# EAGLE design Lamp Logic Board (EAGLE 9.4.2)
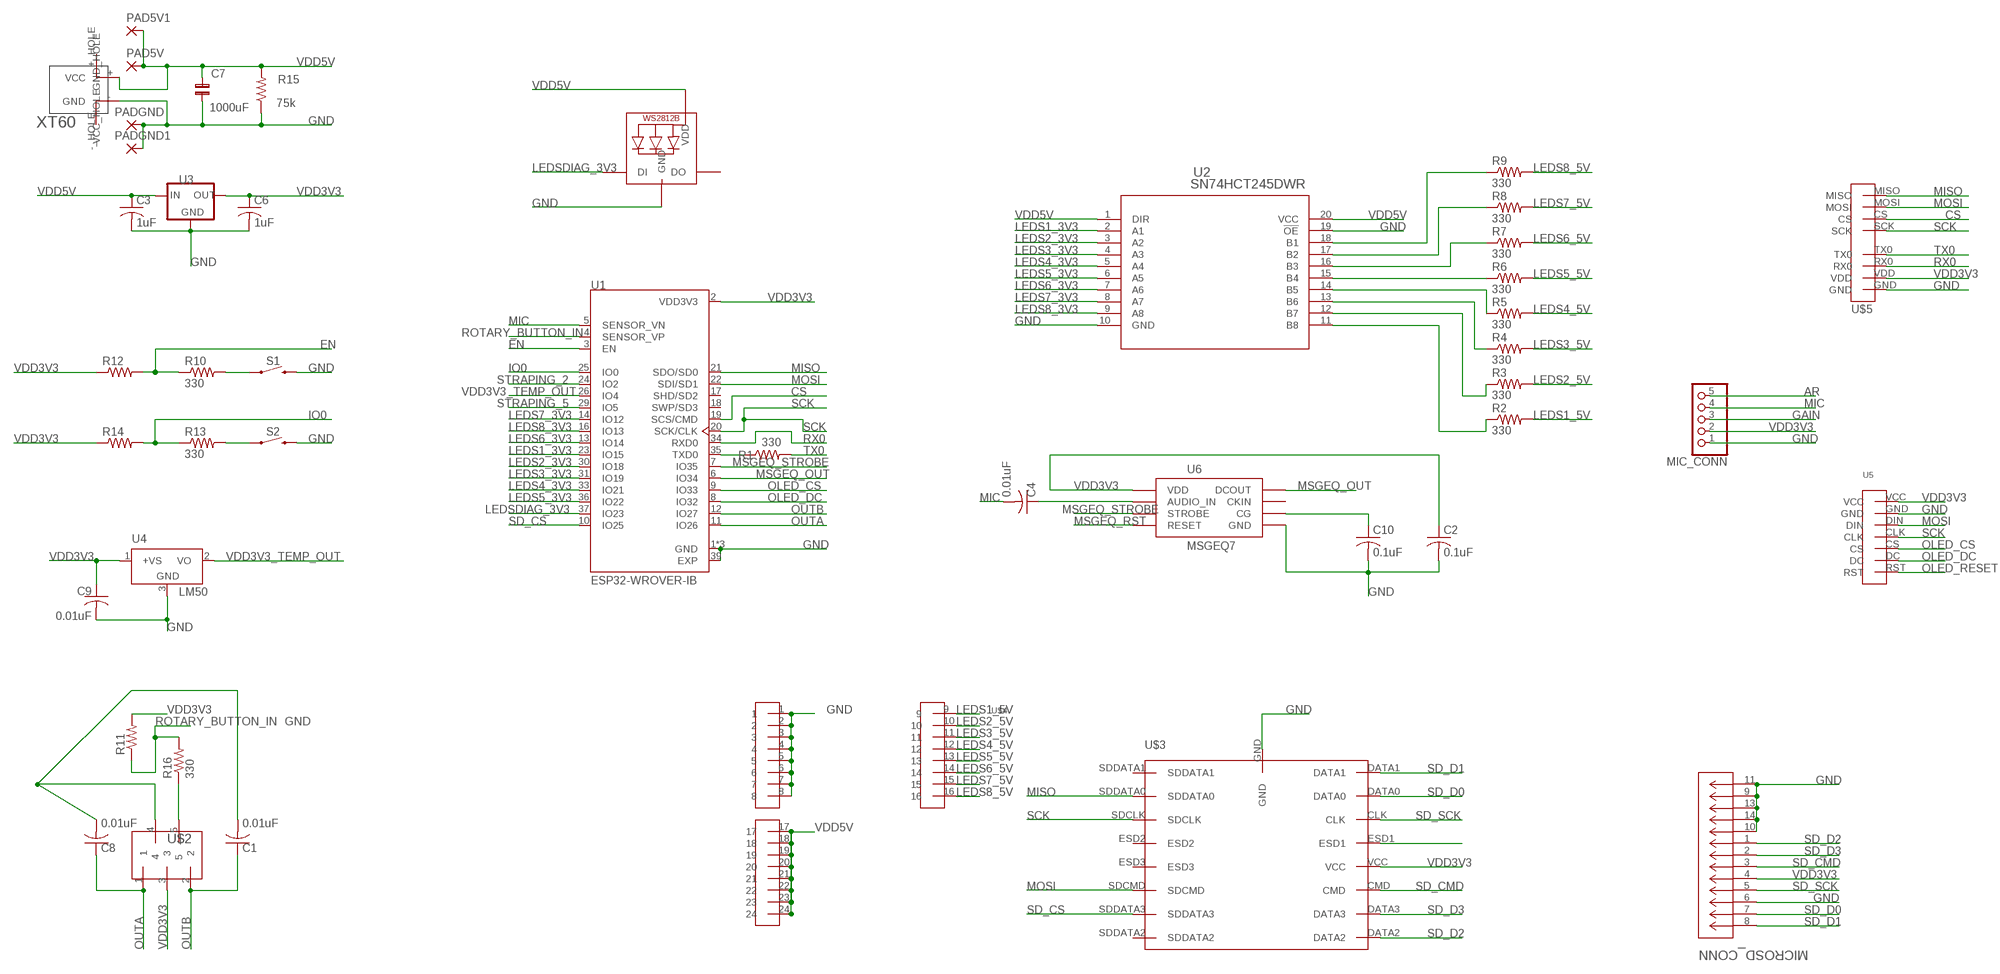
[diagram p0: schematic, sheet 1]

## Parts
C1  0.01uF  C-USC0402  [C0402]
C2  0.1uF  C-USC0805  [C0805]
C3  1uF  C-USC0402  [C0402]
C4  0.01uF  C-USC0402  [C0402]
C6  1uF  C-USC0402  [C0402]
C7  1000uF  C-BP-2,0X5  [ENP2,0-5]
C8  0.01uF  C-USC0402  [C0402]
C9  0.01uF  C-USC0402  [C0402]
C10  0.1uF  C-USC0805  [C0805]
LED1  WS2812B5050  [WS2812B]
MIC_CONN  PINHD-1X5  [1X05]
MICROSD_CONN  LLC  [CON00218_8]
PAD5V  SMD5  [SMD2,54-5,08]
PAD5V1  SMD5  [SMD2,54-5,08]
PADGND  SMD5  [SMD2,54-5,08]
PADGND1  SMD5  [SMD2,54-5,08]
R1  330  R-US_R1206  [R1206]
R2  330  R-US_R1206  [R1206]
R3  330  R-US_R1206  [R1206]
R4  330  R-US_R1206  [R1206]
R5  330  R-US_R1206  [R1206]
R6  330  R-US_R1206  [R1206]
R7  330  R-US_R1206  [R1206]
R8  330  R-US_R1206  [R1206]
R9  330  R-US_R1206  [R1206]
R10  330  R-US_R1206  [R1206]
R11  R-US_R0603  [R0603]
R12  R-US_R0603  [R0603]
R13  330  R-US_R1206  [R1206]
R14  R-US_R0603  [R0603]
R15  75k  R-US_0309/12  [0309/12]
R16  330  R-US_R1206  [R1206]
S1  MOMENTARY-SWITCH-SPST-SMD-6.0X3.5MM  [TACTILE_SWITCH_SMD_6.0X3.5MM]
S2  MOMENTARY-SWITCH-SPST-SMD-6.0X3.5MM  [TACTILE_SWITCH_SMD_6.0X3.5MM]
U1  ESP32-WROVER-IB  ESP32-WROVER-I  [XCVR_ESP32-WROVER-I]
U2  SN74HCT245DWR  [DW20]
U3  LM1117MP-1.8  [SOT223]
U4  LM50  [SOT23]
U5  SPIOLED_STANDOFF  [SPIOLED_STADOFF]
U6  MSGEQ7DIL  [DIL-08]
U$1  XT60  [XT60]
U$2  EN11-HSM1AF15  [EN11-HSM]
U$3  CM1624-08DE  [CM1624-08DE]
U$4  3X8PINHEAD  [3X8PINHEAD]
U$5  2X4PINHEAD  [2X4PINHEAD]

## Nets
AR: MIC_CONN.5
CS: U1.19(SCS/CMD) U$5.CS
EN: R10.1 R12.2 U1.3(EN)
GAIN: MIC_CONN.3
GND: C1.2 C2.2 C3.2 C6.2 C7.1 C8.2 C9.2 C10.2 LED1.3-GND(GND) MIC_CONN.1 MICROSD_CONN.6 MICROSD_CONN.9 MICROSD_CONN.10 MICROSD_CONN.11 MICROSD_CONN.13 MICROSD_CONN.14 PADGND1.1(P) PADGND.1(P) R15.1 S1.2 S2.2 U1.1(GND) U1.15(GND) U1.38(GND) U1.39(EXP) U2.10(GND) U2.19(!OE) U3.1(GND) U4.3(GND) U5.GND U6.2(GND) U$1.-(GND) U$2.4 U$3.GND U$4.1 U$4.2 U$4.3 U$4.4 U$4.5 U$4.6 U$4.7 U$4.8 U$5.GND
IO0: R13.1 R14.2 U1.25(IO0)
LEDS1_3V3: U1.23(IO15) U2.2(A1)
LEDS1_5V: R2.2 U$4.9
LEDS2_3V3: U1.30(IO18) U2.3(A2)
LEDS2_5V: R3.2 U$4.10
LEDS3_3V3: U1.31(IO19) U2.4(A3)
LEDS3_5V: R4.2 U$4.11
LEDS4_3V3: U1.33(IO21) U2.5(A4)
LEDS4_5V: R5.2 U$4.12
LEDS5_3V3: U1.36(IO22) U2.6(A5)
LEDS5_5V: R6.2 U$4.13
LEDS6_3V3: U1.13(IO14) U2.7(A6)
LEDS6_5V: R7.2 U$4.14
LEDS7_3V3: U1.14(IO12) U2.8(A7)
LEDS7_5V: R8.2 U$4.15
LEDS8_3V3: U1.16(IO13) U2.9(A8)
LEDS8_5V: R9.2 U$4.16
LEDSDIAG_3V3: LED1.4-DIN(DI) U1.37(IO23)
MIC: C4.2 MIC_CONN.4 U1.5(SENSOR_VN)
MISO: U1.21(SDO/SD0) U$3.SDDATA0 U$5.MISO
MOSI: U1.22(SDI/SD1) U5.DIN U$3.SDCMD U$5.MOSI
MSGEQ_OUT: U1.6(IO34) U6.3(DCOUT)
MSGEQ_RST: U6.7(RESET)
MSGEQ_STROBE: U1.7(IO35) U6.4(STROBE)
N$1: R9.1 U2.18(B1)
N$2: R1.1 U1.35(TXD0)
N$3: C4.1 U6.5(AUDIO_IN)
N$4: C10.1 U6.6(CG)
N$5: R16.1 U$2.5
N$6: R8.1 U2.17(B2)
N$7: R13.2 S2.1
N$8: U$3.ESD1
N$9: R10.2 S1.1
N$10: R7.1 U2.16(B3)
N$11: R6.1 U2.15(B4)
N$12: R5.1 U2.14(B5)
N$13: R4.1 U2.13(B6)
N$14: R3.1 U2.12(B7)
N$15: R2.1 U2.11(B8)
OLED_CS: U1.9(IO33) U5.CS
OLED_DC: U1.8(IO32) U5.DC
OLED_RESET: U5.RST
OUTA: C8.1 U1.11(IO26) U$2.1
OUTB: C1.1 U1.12(IO27) U$2.2
ROTARY_BUTTON_IN: R11.1 R16.2 U1.4(SENSOR_VP)
RX0: U1.34(RXD0) U$5.RX0
SCK: U1.20(SCK/CLK) U5.CLK U$3.SDCLK U$5.SCK
SD_CMD: MICROSD_CONN.3 U$3.CMD
SD_CS: U1.10(IO25) U$3.SDDATA3
SD_D0: MICROSD_CONN.7 U$3.DATA0
SD_D1: MICROSD_CONN.8 U$3.DATA1
SD_D2: MICROSD_CONN.1 U$3.DATA2
SD_D3: MICROSD_CONN.2 U$3.DATA3
SD_SCK: MICROSD_CONN.5 U$3.CLK
STRAPING_2: U1.24(IO2)
STRAPING_5: U1.29(IO5)
TX0: R1.2 U$5.TX0
VDD3V3: C2.1 C6.1 C9.1 MIC_CONN.2 MICROSD_CONN.4 R11.2 R12.1 R14.1 U1.2(VDD3V3) U3.2(OUT) U3.4(OUT) U4.1(+VS) U5.VCC U6.1(VDD) U$2.3 U$3.VCC U$5.VDD
VDD3V3_TEMP_OUT: U1.26(IO4) U4.2(VO)
VDD5V: C3.1 C7.2 LED1.1-VDD(VDD) PAD5V1.1(P) PAD5V.1(P) R15.2 U2.1(DIR) U2.20(VCC) U3.3(IN) U$1.+(VCC) U$4.17 U$4.18 U$4.19 U$4.20 U$4.21 U$4.22 U$4.23 U$4.24
Unconnected: LED1.2-DOUT(DO) U1.17(SHD/SD2) U1.18(SWP/SD3) U6.8(CKIN) U$1.+_HOLE(VCC_HOLE) U$1.-_HOLE(GND_HOLE) U$3.ESD2 U$3.ESD3 U$3.SDDATA1 U$3.SDDATA2

## Library data of the parts
C1-C4 C6 C8-C10 = resistor:C-US: CAPACITOR, American symbol
C7 = cap-pan40:C-BP: BIPOLAR ELECTROLYTIC
LED1 = WS2812B:WS2812B; AVAILABILITY: Unavailable; DESCRIPTION: Intelligent Control Led Integrated Light Source Pack Of 10; MF: Seeed Technology; MP: WS2812B; PACKAGE: None; PRICE: None
MIC_CONN = pinhead:PINHD-1X5: PIN HEADER
MICROSD_CONN = 5027740891:LLC; MANUFACTURER_PART_NUMBER: LLC; VENDOR: Molex Connector Corporation
PAD5V PAD5V1 PADGND PADGND1 = wirepad:SMD5: SMD PAD
R1-R16 = resistor:R-US_: RESISTOR, American symbol
S1 S2 = SparkFun-Switches:MOMENTARY-SWITCH-SPST: Momentary Switch (Pushbutton) - SPST Normally-open (NO) SPST momentary switches (buttons, pushbuttons). Variants PTH-12MM - 12mm square, through-hole Momentary Pushbutton Switch - 12mm Square <https://www.sparkfun.com/products/9190> (COM-09190) PTH-6.0MM, PTH-6.0MM-KIT - 6.0mm square, through-hole Mini Pushbutton Switch <https://www.sparkfun.com/products/97> (COM-00097) KIT package intended for soldering kit's - only one side of pads' copper is exposed. PTH-RIGHT-ANGLE-KIT - Right-angle, through-hole Right Angle Tactile Button <https://www.sparkfun.com/products/10791> - Used on SparkFun BigTime Watch Kit <https://www.sparkfun.com/products/11734> SMD-12MM - 12mm square, surface-mount Tactile Button - SMD (12mm) <https://www.sparkfun.com/products/12993> (COM-12993) Used on SparkFun PicoBoard <https://www.sparkfun.com/products/11888> SMD-4.5MM - 4.5mm Square Trackball Switch Used on SparkFun Blackberry Trackballer Breakout <https://www.sparkfun.com/products/13169> SMD-4.6MMX2.8MM - 4.60mm x 2.80mm, surface mount Used on SparkFun SAMD21 Mini Breakout <https://www.sparkfun.com/products/13664> SMD-5.2MM, SMD-5.2-REDUNDANT - 5.2mm square, surface-mount Mini Pushbutton Switch - SMD <https://www.sparkfun.com/products/8720> (COM-08720) Used on Arduino Pro Mini <https://www.sparkfun.com/products/11114> REDUNDANT package connects both switch circuits together SMD-6.0X3.5MM - 6.0 x 3.5mm, surface mount Momentary Reset Switch SMD <https://www.sparkfun.com/products/8229> (COM-08229) SMD-6.2MM-TALL - 6.2mm square, surface mount Tactile Button - SMD (6mm) <https://www.sparkfun.com/products/12992> Used on SparkFun Digital Sandbox <https://www.sparkfun.com/products/12651> SMD-RIGHT-ANGLE - Right-angle, surface mount Used on SparkFun Block for Intel® Edison - Arduino <https://www.sparkfun.com/products/13036>; PROD_ID: SWCH-00815; SF_SKU: COM-08229
U1 = ESP32-WROVER-I:ESP32-WROVER-I: Module: combo; GPIO, I2C x2, I2S x2, SDIO, SPI x3, UART x3; U.FL; AVAILABILITY: Unavailable; DESCRIPTION: Module: combo; GPIO, I2C x2, I2S x2, SDIO, SPI x3, UART x3; U.FL; MF: Espressif Systems; MP: ESP32-WROVER-I; PACKAGE: Module Espressif Systems; PRICE: None
U2 = SN74HCT245DWR :SN74HCT245DWR; MANUFACTURER_PART_NUMBER: SN74HCT245DWR; VENDOR: Texas Instruments
U3 = lm1117:LM1117?-*: 800mA Low-Dropout Linear Regulator Source: http://ww1.microchip.com/downloads/en/DeviceDoc/39760d.pdf; MF: Texas Instruments; MPN: LM1117MP-1.8; OC_FARNELL: 1469053; OC_NEWARK: 41K3467
U4 = linear:LM50: SOT-23 Single-Supply Centigrade Temperature Sensor Vout = (10mV/°C x Temp °C) +5mmmV Source: http://cache.national.com/ds/LM/LM50.pdf
U5 = SPIOLED-STANDOFF:SPIOLED_STANDOFF
U6 = MSGEQ7:MSGEQ7: 7-band graphic equalizer; DESCRIPTION: Seven Band Graphic Equalizer Display Filter; DIGI-KEY_PART_NUMBER: 1568-1544-ND; DIGI-KEY_PURCHASE_URL: https://www.digikey.com/product-detail/en/sparkfun-electronics/DEV-13116/1568-1544-ND/5764478?utm_source=snapeda&utm_medium=aggregator&utm_campaign=symbol; MF: SparkFun Electronics; MP: MSGEQ7; PACKAGE: SOIC-8 Mixed Signal Integration
U$1 = XT60:XT60: XT60
U$2 = untitled:EN11-HSM1AF15
U$3 = CM1624-08DE:CM1624-08DE
U$4 = 3X8PINHEAD:3X8PINHEAD
U$5 = 2X4PINHEAD:2X4PINHEAD

## Board
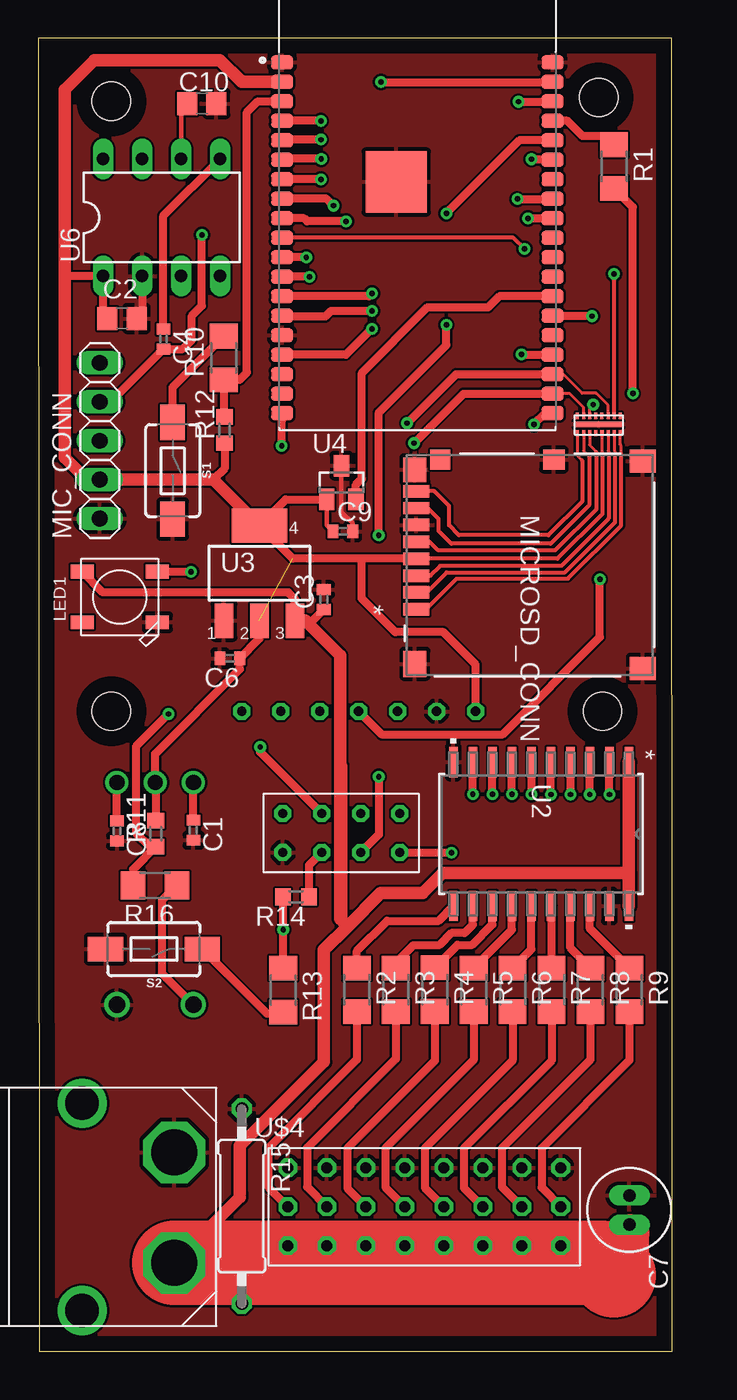
[diagram p1: board, top side]
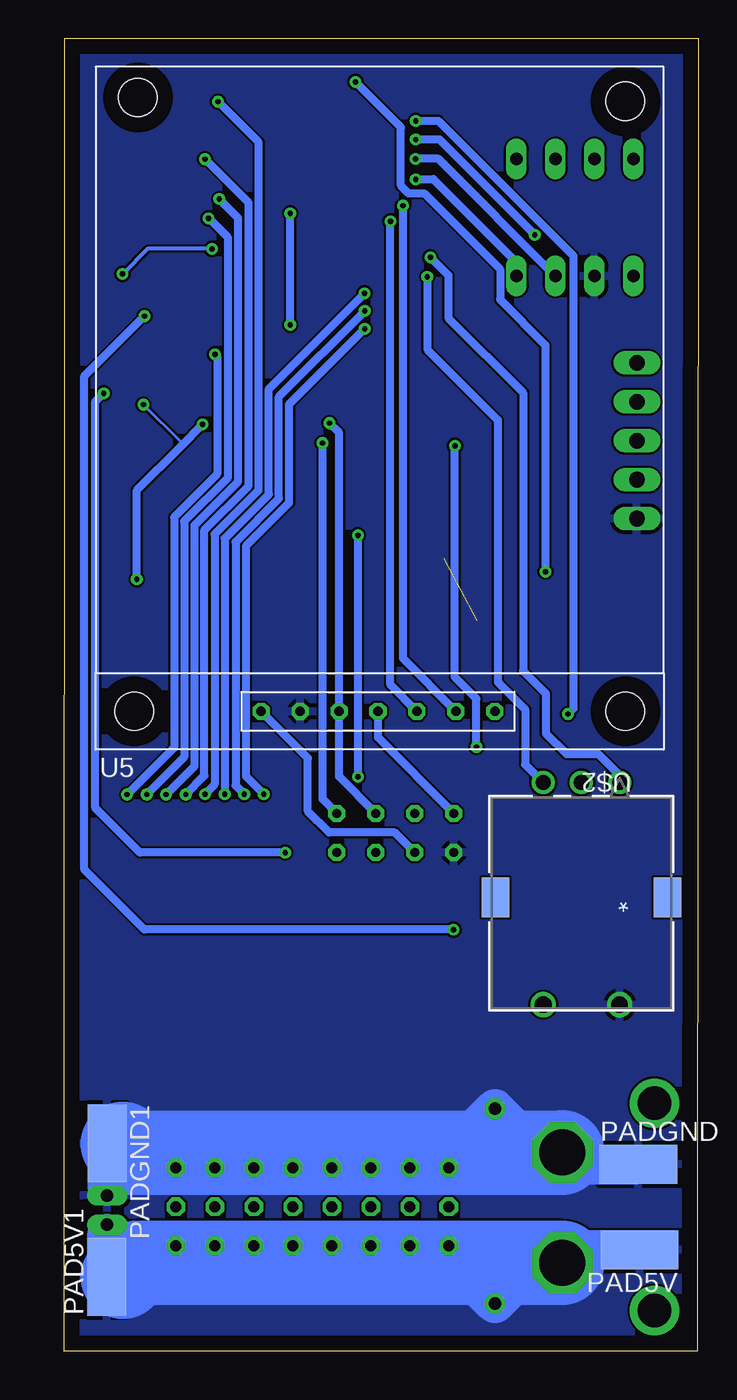
[diagram p2: board, bottom side, seen from below]

Size 41.3 x 85.55 mm. Coordinates in mm from the lower left corner, seen from the top.
Outline: 0.05,0 41.3,0 41.25,85.55 0,85.55 0.05,0
Copper layers (1*16): Top 0.035mm / dielectric 1.5mm / Bottom 0.035mm
Design rules "default": minimum track width 6mil, minimum drill 0.35mm, track to track 6mil, track to pad 6mil, pad to pad 6mil, via to via 6mil, smd to smd 6mil, copper to edge 40mil, drill to drill 6mil, minimum pad ring 10mil, minimum via ring 8mil, stop-mask expansion 4mil, vias tented up to drill 0mil, thermal gap 10mil

### Footprints (pad centres in the part's own frame; a part is rotated, then mirrored left to right if it is on the bottom)
C0402 = smd 0.7 x 0.9: 1 -0.65,0; 2 0.65,0
C0805 = smd 1.3 x 1.5: 1 -0.95,0; 2 0.95,0
ENP2,0-5 = drill 0.813 pad 1.27 long: 1 -0.953,0; 2 0.953,0
WS2812B = smd 1.5 x 0.9: 1-VDD 2.45,-1.65; 2-DOUT 2.45,1.65; 3-GND -2.45,1.65; 4-DIN -2.45,-1.65
1X05 = drill 1.016 long: 1 -5.08,0; 2 -2.54,0; 3 0,0; 4 2.54,0; 5 5.08,0
CON00218_8 = smd 0.813 x 1.676: 1 2.899,-7.387; 2 1.799,-7.387; 3 0.699,-7.387; 4 -0.401,-7.387; 5 -1.501,-7.387; 6 -2.601,-7.387; 7 -3.701,-7.387; 8 -4.801,-7.387 | smd 1.499 x 1.702: 9 -6.751,7.374; 10 6.751,7.374 | smd 1.295 x 1.397: 11 -6.859,1.577 | smd 1.295 x 1.295: 12 -6.859,-5.823 | smd 1.6 x 1.499: 13 -6.201,-7.476 | smd 1.702 x 1.499: 14 6.449,-7.476
SMD2,54-5,08 = smd 2.54 x 5.08: 1 0,0
R1206 = smd 1.6 x 1.803: 1 -1.422,0; 2 1.422,0
R0603 = smd 1 x 1.1: 1 -0.85,0; 2 0.85,0
0309/12 = drill 0.813 octagon: 1 -6.35,0; 2 6.35,0
TACTILE_SWITCH_SMD_6.0X3.5MM = smd 2.3 x 1.6: 1 -3.15,0; 2 3.15,0
XCVR_ESP32-WROVER-I = smd 1.45 x 0.93: 1 -8.81,8.26; 2 -8.81,6.99; 3 -8.81,5.72; 4 -8.81,4.45; 5 -8.81,3.18; 6 -8.81,1.91; 7 -8.81,0.64; 8 -8.81,-0.63; 9 -8.81,-1.9; 10 -8.81,-3.17; 11 -8.81,-4.44; 12 -8.81,-5.71; 13 -8.81,-6.98; 14 -8.81,-8.25; 15 -8.81,-9.52; 16 -8.81,-10.79; 17 -8.81,-12.06; 18 -8.81,-13.33; 19 -8.81,-14.6; 20 8.81,-14.6; 21 8.81,-13.33; 22 8.81,-12.06; 23 8.81,-10.79; 24 8.81,-9.52; 25 8.81,-8.25; 26 8.81,-6.98; 27 8.81,-5.71; 28 8.81,-4.44; 29 8.81,-3.17; 30 8.81,-1.9; 31 8.81,-0.63; 32 8.81,0.64; 33 8.81,1.91; 34 8.81,3.18; 35 8.81,4.45; 36 8.81,5.72; 37 8.81,6.99; 38 8.81,8.26 | smd 4 x 4: 39 -1.38,0.47
DW20 = smd 1.981 x 0.559: 1 -4.686,5.715; 2 -4.686,4.445; 3 -4.686,3.175; 4 -4.686,1.905; 5 -4.686,0.635; 6 -4.686,-0.635; 7 -4.686,-1.905; 8 -4.686,-3.175; 9 -4.686,-4.445; 10 -4.686,-5.715; 11 4.686,-5.715; 12 4.686,-4.445; 13 4.686,-3.175; 14 4.686,-1.905; 15 4.686,-0.635; 16 4.686,0.635; 17 4.686,1.905; 18 4.686,3.175; 19 4.686,4.445; 20 4.686,5.715
SOT223 = smd 1.219 x 2.235: 1 -2.311,-3.099; 2 0,-3.099; 3 2.311,-3.099 | smd 3.6 x 2.2: 4 0,3.099
SOT23 = smd 1 x 1.4: 1 -0.95,-1.1; 2 0.95,-1.1; 3 0,1.1
SPIOLED_STADOFF = drill 0.6 octagon: CLK 18.39,2.5; CS 20.93,2.5; DC 23.47,2.5; DIN 15.85,2.5; GND 13.31,2.5; RST 26.01,2.5; VCC 10.77,2.5 | hole 2.5: 2.5,2.5; 34.5,2.5; 34.5,42.25; 2.75,42.5
DIL-08 = drill 0.813 long: 1 -3.81,-3.81; 2 -1.27,-3.81; 3 1.27,-3.81; 4 3.81,-3.81; 5 3.81,3.81; 6 1.27,3.81; 7 -1.27,3.81; 8 -3.81,3.81
XT60 = drill 3 octagon: + 4.1,2.75; - 11.3,2.75 | drill 2.184 pad 2.438: +_HOLE 1,8.75 | drill 2.184 pad 2.413: -_HOLE 14.5,8.75
EN11-HSM = drill 0.991 pad 1.499: 1 -2.489,7.874; 2 2.489,7.874; 3 0,7.874 | drill 1.092 pad 1.6: 4 -2.489,22.352; 5 2.489,22.352 | smd 1.803 x 2.591: 6 -5.601,15.354; 7 5.601,15.354
CM1624-08DE = smd 0.2 x 0.4: CLK 1,0; CMD 2.2,0; DATA0 0.6,0; DATA1 0.2,0; DATA2 3,0; DATA3 2.6,0; ESD1 1.4,0; ESD2 1.4,1.125; ESD3 1.775,1.125; SDCLK 1,1.125; SDCMD 2.2,1.125; SDDATA0 0.6,1.125; SDDATA1 0.2,1.125; SDDATA2 3,1.125; SDDATA3 2.6,1.125; VCC 1.8,0 | smd 3 x 0.35: GND 1.575,0.575
3X8PINHEAD = drill 0.7 octagon: 1 0,0; 2 2.54,0; 3 5.08,0; 4 7.62,0; 5 10.16,0; 6 12.7,0; 7 15.24,0; 8 17.78,0; 9 0,-2.54; 10 2.54,-2.54; 11 5.08,-2.54; 12 7.62,-2.54; 13 10.16,-2.54; 14 12.7,-2.54; 15 15.24,-2.54; 16 17.78,-2.54; 17 0,-5.08; 18 2.54,-5.08; 19 5.08,-5.08; 20 7.62,-5.08; 21 10.16,-5.08; 22 12.7,-5.08; 23 15.24,-5.08; 24 17.78,-5.08
2X4PINHEAD = drill 0.6 octagon: CS 3.81,3.81; GND 1.27,1.27; MISO 8.89,3.81; MOSI 6.35,3.81; RX0 6.35,1.27; SCK 1.27,3.81; TX0 8.89,1.27; VDD 3.81,1.27

### Placement (x,y rotation side)
C1  10.1,33.95 270 top
C2  5.45,67.3 0 top
C3  18.6,48.98 90 top
C4  8.15,65.95 270 top
C6  12.47,45.15 180 top
C7  38.5,9.2 270 top
C8  5.12,33.9 270 top
C9  19.84,53.43 0 top
C10  10.65,81.3 0 top
LED1  5.3,49.15 180 top
MIC_CONN  4,59.34 90 top
MICROSD_CONN  32.01,51.24 270 top
PAD5V  3.83,6.6 90 bottom
PAD5V1  38.52,4.85 0 bottom
PADGND  3.9,12.17 270 bottom
PADGND1  38.5,13.55 180 bottom
R1  37.5,77.2 270 top
R2  20.75,23.55 270 top
R3  23.29,23.55 270 top
R4  25.82,23.56 270 top
R5  28.36,23.55 270 top
R6  30.89,23.55 270 top
R7  33.43,23.55 270 top
R8  35.96,23.55 270 top
R9  38.5,23.55 270 top
R10  12.07,64.73 90 top
R11  7.65,33.73 90 top
R12  12.12,60.03 90 top
R13  15.95,23.52 270 top
R14  16.79,29.59 180 top
R15  13.25,9.45 270 top
R16  7.6,30.35 180 top
S1  8.75,57.38 270 top
S2  7.53,26.2 180 top
U1  24.69,75.73 0 top
U2  32.75,33.7 270 top
U3  14.4,50.7 0 top
U4  19.74,56.6 0 top
U5  39.25,39.2 0 bottom
U6  8.03,73.88 0 top
U$1  11.6,1.65 90 top
U$2  7.61,44.93 180 bottom
U$3  34.91,59.83 0 top
U$4  16.25,11.95 0 top
U$5  14.65,31.22 0 top

### Tracks (layer width: path | path; a pad name or v marks a point on that pad's centre or on a via)
CS  (via drill 0.35)
  Top 0.508: 15.88,60.66 U1.19 15.85,61.1 v15.85,59 | U$5.CS 14.45,39.05 v14.45,39.38
  Bottom 0.508: v14.45,39.38 14.45,42.53 15.85,43.93 v15.85,59
EN
  Top 0.508: R12.2 12.07,60.93 R10.1 13.1,63.3 13.57,63.78 13.57,80.73 14.29,81.45 U1.3 15.39,81.45
GND
  Top 0.305: C9.2 20.48,53.95 19.74,54.7 U4.3
  Top 0.508: U6.2 6.76,67.66 C2.2
  Bottom 1.27: U$4.8 36.7,11.95 C7.1 PADGND1.1
  Bottom 2.54: PADGND.1 3.92,12.15 8.05,12.15 U$1.- 10.4,12.95 R15.1 16.25,12.8 U$4.1 U$4.2 U$4.3 U$4.4 U$4.5 U$4.6 U$4.7 U$4.8 36.9,11.95 PADGND1.1 | PADGND1.1 38.5,10.96 | PADGND1.1 38.5,10.72
  Bottom 5.5: U$1.- 8.88,12.92 36.88,12.92 37.48,13.52
  pour Top: -0.03,-1.03 -0.03,85.08 0.52,85.62 41.4,85.62 41.4,-0.9
  pour Bottom: 0.07,85.62 41.02,85.62 41.23,85.42 41.23,-3.78 41.15,-3.85 0,-3.85 -0.1,-3.95
IO0  (via drill 0.35)
  Top 0.508: 16.03,25.03 R13.1 v15.95,27.47 R14.2 | v36.08,67.45 33.5,67.45 U1.25
  Bottom 0.508: v15.95,27.47 36.08,27.47 39.98,31.38 39.98,63.55 v36.08,67.45
LEDS1_3V3  (via drill 0.35)
  Top 0.254: v31.48,64.95 31.49,64.94
  Top 0.508: 37.17,38.37 U2.2 v37.2,36.28 | v31.48,64.95 33.48,64.95 U1.23
  Bottom 0.508: v31.48,64.95 31.3,64.78 31.3,57.2 34.15,54.35 34.15,39.33 v37.2,36.28
LEDS1_5V
  Top 0.508: R2.2 20.75,19 14.97,13.22 14.97,10.68 U$4.9
LEDS2_3V3  (via drill 0.35)
  Top 0.305: U2.3 35.92,39.11
  Top 0.508: v31.9,73.83 U1.30 | v35.92,36.28 U2.3
  Bottom 0.508: v31.9,73.83 30.62,72.55 30.62,56.94 33.49,54.08 33.49,38.71 v35.92,36.28
LEDS2_5V
  Top 0.508: R3.2 23.29,19.04 17.5,13.25 17.5,10.7 U$4.10
LEDS3_3V3  (via drill 0.35)
  Top 0.254: 33.48,75.08 U1.31 | v31.2,75.08 31.22,75.09
  Top 0.508: v31.2,75.08 33.48,75.08 | v34.67,36.28 34.67,38.37 U2.4
  Bottom 0.508: v31.2,75.08 29.96,73.84 29.96,56.67 32.83,53.81 32.83,38.11 34.66,36.28 v34.67,36.28
LEDS3_5V
  Top 0.508: R4.2 25.82,18.92 20.12,13.22 20.12,10.61 U$4.11
LEDS4_3V3  (via drill 0.35)
  Top 0.254: U1.33 33.48,77.66
  Top 0.508: v32.12,77.67 33.46,77.67 33.48,77.66 | v33.38,36.28 U2.5
  Bottom 0.508: v32.12,77.67 29.29,74.84 29.29,56.38 32.17,53.51 32.17,37.51 v33.38,36.29 v33.38,36.28
LEDS4_5V
  Top 0.508: R5.2 28.36,18.98 22.6,13.22 22.6,10.68 U$4.12
LEDS5_3V3  (via drill 0.35)
  Top 0.508: v31.27,81.42 33.48,81.42 U1.36 | v32.12,36.3 32.12,38.38 U2.6
  Bottom 0.508: v31.27,81.42 28.63,78.78 28.63,56.11 31.51,53.24 31.51,36.94 32.12,36.32 v32.12,36.3
LEDS5_5V
  Top 0.508: R6.2 30.89,18.94 25.18,13.22 25.18,10.64 U$4.13
LEDS6_3V3  (via drill 0.35)
  Top 0.254: U1.13
  Top 0.508: v21.73,68.94 21.55,68.75 U1.13 | v30.84,36.3 U2.7
  Bottom 0.508: v21.73,68.94 27.97,62.7 27.97,55.84 30.84,52.96 v30.84,36.3
LEDS6_5V
  Top 0.508: R7.2 33.43,18.93 27.73,13.22 27.73,10.63 U$4.14
LEDS7_3V3  (via drill 0.35)
  Top 0.254: 15.91,67.45 U1.14
  Top 0.508: v21.73,67.78 19.06,67.78 18.7,67.42 15.93,67.42 U1.14 | v29.57,36.3 U2.8
  Bottom 0.508: v21.73,67.78 27.31,62.2 27.31,55.56 30.14,52.74 30.14,36.86 v29.57,36.3
LEDS7_5V
  Top 0.508: R8.2 35.96,18.99 30.2,13.22 30.2,10.7 U$4.15
LEDS8_3V3  (via drill 0.35)
  Top 0.254: 15.91,64.9 U1.16
  Top 0.508: v21.73,66.62 20.04,64.94 U1.16 | v28.3,36.3 U2.9
  Bottom 0.508: v21.73,66.62 26.65,61.7 26.65,55.29 29.48,52.46 29.48,37.48 v28.3,36.3
LEDS8_5V
  Top 0.508: R9.2 38.5,18.95 32.77,13.22 32.77,10.66 U$4.16
LEDSDIAG_3V3  (via drill 0.35)
  Top 0.508: LED1.4-DIN v9.95,50.8 | U1.37 33.48,82.7 v22.32,82.7
  Bottom 0.508: v22.32,82.7 19.38,79.75 19.38,75.95 18.88,75.45 17.85,75.45 12.91,70.51 12.91,68.53 9.95,65.58 v9.95,50.8
MIC  (via drill 0.35)
  Top 0.508: MIC_CONN.4 4.72,61.88 C4.2 9.4,65.3 10,65.9 10,67.48 10.65,68.12 v10.65,72.75 | U1.5 15.93,78.95 v18.4,78.95
  Bottom 0.508: v10.65,72.75 16.85,78.95 v18.4,78.95
MISO  (via drill 0.35)
  Top 0.2: U$3.SDDATA0 35.52,61.5 34.62,62.4 U1.21
  Top 0.254: 33.84,62.4 U1.21
  Top 0.508: v24.48,59.18 27.7,62.4 U1.21
  Bottom 0.508: U$5.MISO 24.48,35.97 v24.48,59.18
MOSI  (via drill 0.35)
  Top 0.2: U$3.SDCMD 37.12,61.65 36.34,62.43 35.42,62.43 34.19,63.67 U1.22
  Top 0.508: v24.02,60.48 27.21,63.67 U1.22
  Bottom 0.508: U$5.MOSI 23.4,37.44 U5.DIN 23.4,59.85 v24.02,60.48
MSGEQ_OUT  (via drill 0.35)
  Top 0.508: U1.6 15.95,77.7 v18.43,77.7
  Bottom 0.508: U6.3 16.93,77.7 v18.43,77.7
MSGEQ_STROBE  (via drill 0.35)
  Top 0.508: v18.4,76.35 18.39,76.37 U1.7
  Bottom 0.508: U6.4 11.84,70.97 17.25,76.38 18.38,76.38 v18.4,76.35
N$1
  Top 0.508: R9.1 35.92,27.55 U2.18
N$2
  Top 0.508: R1.1 36.94,79.18 35.46,79.18 34.46,80.17 U1.35
N$3
  Top 0.508: C4.1 8.15,74 U6.5
N$4
  Top 0.305: C10.1 9.3,80.9 U6.6
N$5
  Top 0.508: R16.1 8.05,29.38 8.05,24.63 U$2.5
N$6
  Top 0.508: R8.1 34.66,26.28 U2.17
N$7
  Top 0.508: R13.2 15.95,22 14.88,22 S2.1
N$9
  Top 0.508: S1.1 8.75,62.82 R10.2
N$10
  Top 0.508: R7.1 33.43,28.97 U2.16
N$11
  Top 0.508: R6.1 32.12,26.19 U2.15
N$12
  Top 0.508: R5.1 30.84,27.46 U2.14
N$13
  Top 0.508: R4.1 27.31,26.47 28.25,26.47 29.57,27.8 U2.13
N$14
  Top 0.508: 28.3,28.38 U2.12 28.3,27.78 27.77,27.25 26.9,27.25 26.1,26.45 24.43,26.45 23.29,25.31 R3.1
N$15
  Top 0.508: 27.04,28.86 U2.11 26.07,28.05 22.73,28.05 20.75,26.07 R2.1
OLED_CS  (via drill 0.35)
  Top 0.508: v20.05,73.62 17.5,73.62 17.3,73.83 U1.9
  Bottom 0.508: U5.CS 20.05,43.43 v20.05,73.62
OLED_DC  (via drill 0.35)
  Top 0.508: v19.23,74.65 18.78,75.09 U1.8
  Bottom 0.508: U5.DC 19.23,45.15 v19.23,74.65
OUTA  (via drill 0.35)
  Top 0.508: C8.1 5.12,34.47 U$2.1 | v17.45,71.28 U1.11
  Bottom 0.508: U$2.1 5.12,37.52 6.5,38.9 8.57,38.9 9.93,40.25 9.93,42.85 11.4,44.33 11.4,62.45 16.27,67.33 16.27,70.11 v17.45,71.28
OUTB  (via drill 0.35)
  Top 0.508: C1.1 10.1,34.65 U$2.2 | v17.65,70.02 U1.12
  Bottom 0.508: U$2.2 11.28,38.23 11.28,41.83 13.05,43.6 13.05,60.68 17.65,65.28 v17.65,70.02
ROTARY_BUTTON_IN  (via drill 0.35)
  Top 0.508: R16.2 6.18,31.4 R11.1 7.25,32.88 6.35,33.78 6.35,39.4 v8.47,41.53 | v18.4,80.17 U1.4
  Bottom 0.508: v18.4,80.17 16.93,80.17 8.12,71.38 8.12,41.88 v8.47,41.53
RX0  (via drill 0.35)
  Top 0.508: U1.34 31.33,78.91 v26.57,74.15 | v26.57,66.88 26.57,65.58 22.18,61.18 v22.18,53.18 | v22.18,37.44 22.18,33.67 U$5.RX0
  Bottom 0.508: v22.18,53.18 v22.18,37.44 | v26.57,66.88 v26.57,74.15
SCK  (via drill 0.35)
  Top 0.2: U$3.SDCLK 35.91,61.46 v36.15,61.69
  Top 0.508: U5.CLK 22.36,40.2 30.25,40.2 36.58,46.53 v36.58,50.3 | U1.20 33.01,61.12 v32.28,60.4
  Bottom 0.2: v36.15,61.69 33.69,59.23 33.69,58.99
  Bottom 0.254: 33.69,59 33.69,58.99
  Bottom 0.508: U$5.SCK 20.86,39.98 U5.CLK | v36.58,50.3 36.58,56.11 33.69,58.99 v32.28,60.4
SD_CMD
  Top 0.2: 37.15,58.5 37.15,58.63 37.12,58.66 U$3.CMD
  Top 0.254: MICROSD_CONN.3 25.54,50.54 26.18,51.18 34.05,51.18 37.15,54.27 37.15,58.5
SD_CS  (via drill 0.35)
  Top 0.254: v31.67,71.83 30.95,72.56 U1.10 | v37.5,70.2 37.52,70.19 U$3.SDDATA3
  Bottom 0.254: v31.67,71.83 35.87,71.83 v37.5,70.2
SD_D0
  Top 0.2: U$3.DATA0 35.52,58.66 35.88,58.3
  Top 0.254: 35.88,58.3 35.88,55.12 33.38,52.62 26.9,52.62 26.07,53.45 26.07,54.23 25.36,54.94 MICROSD_CONN.7
SD_D1
  Top 0.2: U$3.DATA1 35.12,58.36 35.42,58.05
  Top 0.254: 35.42,58.05 35.42,55.38 33.23,53.18 27.4,53.18 26.75,53.83 26.75,55.08 25.78,56.04 MICROSD_CONN.8
SD_D2
  Top 0.2: U$3.DATA2 37.91,59.05 37.96,59.01 37.96,58.48
  Top 0.254: MICROSD_CONN.1 25.24,48.34 27.24,50.34 34.49,50.34 37.96,53.81 37.96,58.48
SD_D3
  Top 0.2: 37.55,58.48 37.55,58.63 37.52,58.67 U$3.DATA3
  Top 0.254: MICROSD_CONN.2 25.29,49.44 26.6,50.75 34.3,50.75 37.55,54 37.55,58.48
SD_SCK
  Top 0.2: 36.33,58.59 36.33,58.63 35.91,59.05 U$3.CLK
  Top 0.254: MICROSD_CONN.5 25.48,52.74 26.05,52.18 33.65,52.18 36.33,54.86 36.33,58.59
TX0  (via drill 0.35)
  Top 0.508: v38.73,62.43 38.73,74.55 R1.2 | U$5.TX0 v26.9,32.5
  Bottom 0.508: v38.73,62.43 39.27,61.88 39.27,35.4 36.37,32.5 v26.9,32.5
VDD3V3  (1 unrouted)
  Top 0.2: 36.74,58.5 36.72,58.53 U$3.VCC
  Top 0.254: MICROSD_CONN.4 33.82,51.64 36.74,54.57 36.74,58.5
  Top 0.305: C9.1 18.79,53.82 U4.1
  Top 0.508: R11.2 7.65,37.02 U$2.3 7.61,38.93 13.12,44.44 C6.1 14.4,46.43 U3.2 | MICROSD_CONN.4 21.05,51.64 | 21.05,51.64 16.56,51.64 U3.4 16.1,55.5 U4.1 | C2.1 4.22,67.58 U6.1 1.77,70.07 1.73,70.03 | 1.73,70.03 1.73,58.23 | 1.73,70.03 1.73,81.38 | R12.1 12.12,57.52 11.4,56.8 | R14.1 17.64,31.68 U$5.VDD | U5.VCC 28.48,44.75 26.38,46.85 23.25,46.85 21.05,49.05 21.05,51.64
  Top 0.813: U3.4 11.4,56.8 MIC_CONN.2 3.15,56.8 1.73,58.23 1.73,81.38 1.73,82.2 3.64,84.12 11.83,84.12 13.23,82.72 U1.2
  Bottom 0.508: U$5.VDD 19.77,33.8 24.05,33.8 25.43,35.18 25.43,38.65 U5.VCC
VDD3V3_TEMP_OUT
  Top 0.508: U4.2 20.69,56.47 21.07,56.85 21.07,63.75 25.34,68.02 29.3,68.02 30.02,68.75 U1.26
VDD5V
  Top 0.508: 38.47,31.03 38.47,31.15 | 13.12,10.02 13.12,10.27 | 20.14,27.69 19.85,27.97 19.85,38.2 19.65,38.4 19.65,45.33 | C3.1 17.87,47.6 U3.3 16.71,49.03 16.29,49.45 4.2,49.45 LED1.1-VDD
  Top 0.813: U$1.+ 13.12,10.02 | 13.12,10.27 13.12,13.38 18.6,18.85 18.6,26.15 20.14,27.69 22.3,29.85 25.05,29.85 26.35,31.15 38.47,31.15 U2.1 | 19.85,27.97 19.65,28.18 19.65,31.99 19.67,32.01 19.67,35.47 19.65,35.49 19.65,45.33 17.37,47.6 U3.3 | 38.47,31.03 U2.20
  Top 2.54: U$1.+ 9.65,4.95 37.48,4.95 38.52,5.99 38.52,7.67 | U$4.17 U$4.18 U$4.19 U$4.20 U$4.21 U$4.22 U$4.23 U$4.24 | U$4.24 36.15,4.75 38.7,4.75 38.9,4.55 36.35,4.55 U$4.24
  Top 5.5: U$1.+ 36.68,5.75 37.48,4.95
  Bottom 1.27: U$4.24 37.12,6.87 C7.2 38.5,4.88 PAD5V1.1
  Bottom 2.54: PAD5V.1 8,6.6 U$1.+ 10.6,5.75 R15.2 16.25,6.1 U$4.17 | 38.52,7.67 PAD5V1.1 36.51,6.87 U$4.24
  Bottom 5.5: U$1.+ 36.58,5.75 37.48,4.85
  pour Bottom: -1,6.95 44.08,6.95 44.15,6.88 44.15,-1.38 43.75,-1.77 -0.15,-1.77 -1.07,-0.85